# EasyEDA Pro project 25集创赛海云捷讯杯.epro, board PCB14_2
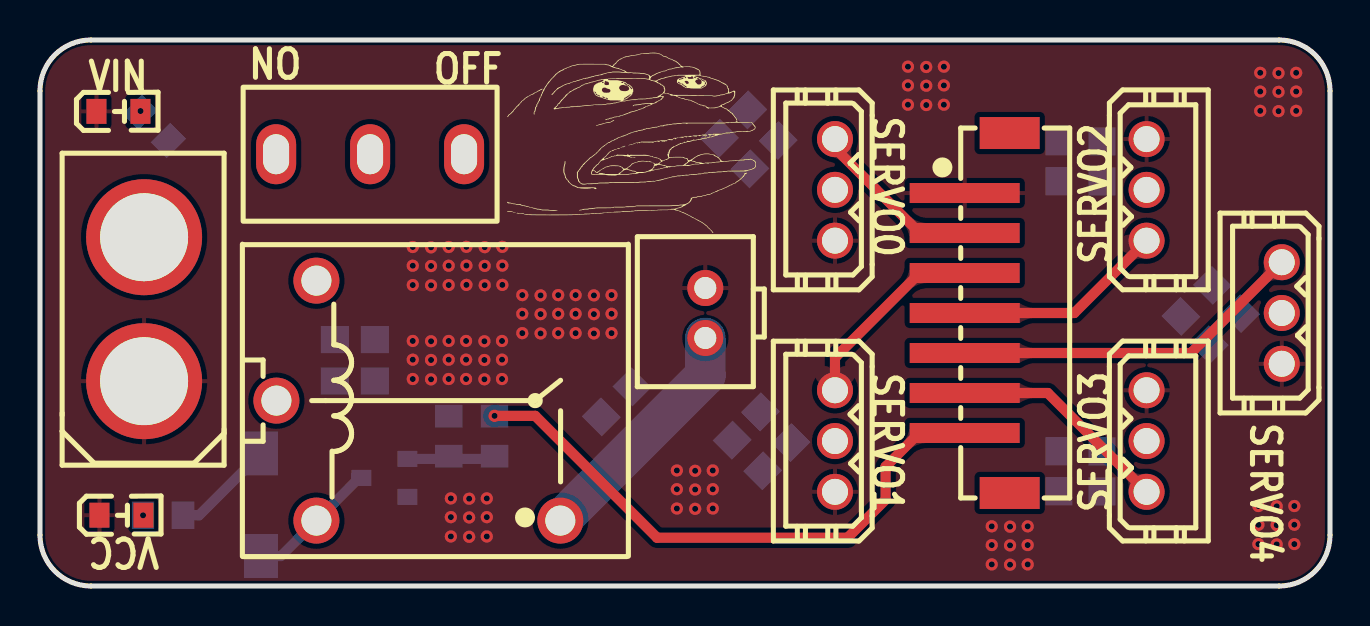
[diagram p12: board, top side]
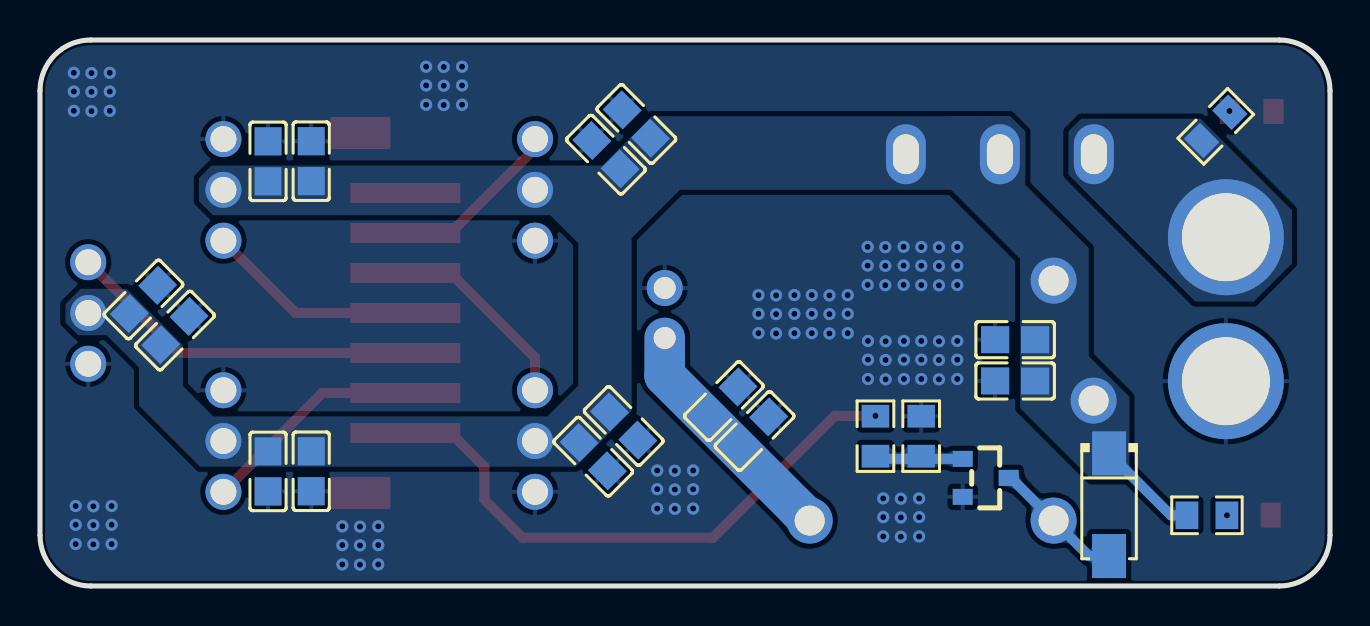
[diagram p13: board, bottom side, seen from below]

Outline 64.52 x 27.31 mm; copper layers: Top Layer, Bottom Layer. Coordinates in mm from the lower left corner of the outline.
Outline path: 0,24.77 0,2.54 arc(0.74,0.74) 2.54,0 61.98,0 arc(63.77,0.74) 64.52,2.54 64.52,24.77 arc(63.77,26.56) 61.98,27.31 2.54,27.31 arc(0.74,26.56) 0,24.77
Stack: Top Layer 0.035mm / Dielectric1 1.51mm FR4 er 4.5 / Bottom Layer 0.035mm

## Design rules (mm)
spacing copperThickness1oz (default): track to track 0.102, other pairs 0.152 to 0.3
spacing copperThickness2oz: track to track 0.203, other pairs 0.152 to 0.3
spacing Plane_innerPlane: track to track 0.102, other pairs 0.152 to 0.3
spacing Copper_copperRegion: track to track 0.102, other pairs 0.152 to 0.3
track width copperThickness1oz (default): min 0.127, default 0.254, max 2.54
track width copperThickness2oz: min 0.203, default 0.254, max 2.54
differential pair differentialPair (default): width min 0.127, default 0.254, max 2.54; gap min 0.152, default 0.152
pour e143 uses Copper_copperRegion
pour e212 uses Copper_copperRegion

## Placement (name value [footprint] x y rotation side)
C34  104  [C0805]  36.21 21.57 225 bottom
C35  106  [C0805]  34.69 23.1 225 bottom
C36  104  [C0805]  35.32 8 45 bottom
C37  106  [C0805]  36.85 6.47 45 bottom
C38  104  [C0805]  53.11 21.24 270 bottom
C39  106  [C0805]  50.95 21.24 270 bottom
C40  104  [C0805]  50.95 5.74 90 bottom
C41  106  [C0805]  53.11 5.73 90 bottom
C79  104  [C0805]  28.78 7.75 315 bottom
C80  106  [C0805]  30.31 9.25 315 bottom
C81  104  [C0805]  15.75 12.32 180 bottom
C82  106  [C0805]  15.75 10.25 180 bottom
C83  104  [C0805]  59.34 14.33 315 bottom
C84  106  [C0805]  57.77 12.77 315 bottom
CN2  5264-3A  [CONN-TH_5264-3A]  39.76 19.81 270 top
CN3  5264-3A  [CONN-TH_5264-3A]  39.76 7.25 270 top
CN4  5264-3A  [CONN-TH_5264-3A]  55.34 19.81 90 top
CN5  5264-3A  [CONN-TH_5264-3A]  55.34 7.25 90 top
CN15  5264-3A  [CONN-TH_5264-3A]  62.1 13.65 270 top
D1  SS14  [SMA_L4.2-W2.6-LS5.3-RD]  11.05 4.06 270 bottom
K1  SRD-5VDC-SL-A  [RELAY-TH_SRD-XXVDC-XX-A]  18.92 9.27 180 top
LED1  -  [LED_0805]  3.97 23.73 0 top
LED2  -  [LED_0805]  4.12 3.54 0 top
Q1  -  [S8050_SOT-23]  17.22 5.53 0 bottom
R7  10K  [R0805]  5.72 22.99 135 bottom
R8  10K  [R0805]  6.15 3.54 180 bottom
R17  10K  [R0805]  20.45 7.49 270 bottom
R18  1K  [R0805]  22.73 7.49 270 bottom
SW4  SS-12D10L5  [SW-TH_SS-12D10L5]  16.51 21.59 180 top
U3  BX-PH2.0-7PLT  [CONN-SMD_7P-P2.00_WAFER-200L-7P]  47.37 13.65 270 top
U17  HC-XHB-2A  [CONN-TH_2P-P2.50_HC-XHB-2AKK]  33.27 13.65 90 top
U18  XT60  [CONN-TH_XT60]  5.21 13.84 90 top

## Footprints (pads in the part's own frame, mm; a bottom-side part is the same pattern mirrored in y, then rotated)
C0805
  rect 1.41x1.35 smd: 1(-1,0) 2(1,0)
CONN-SMD_7P-P2.00_WAFER-200L-7P
  rect 1x5.5 smd: 1(-6,-1.125) 2(-4,-1.125) 3(-2,-1.125) 4(0,-1.125) 5(2,-1.125) 6(4,-1.125) 7(6,-1.125)
  rect 1.6x3 smd: 8(-9,1.125) 9(9,1.125)
CONN-TH_2P-P2.50_HC-XHB-2AKK
  round 1.8 hole 1.1: 1(-1.25,0) 2(1.25,0)
CONN-TH_5264-3A
  round 1.8 hole 1.3: 1(-2.54,0) 2(0,0) 3(2.54,0)
CONN-TH_XT60
  round 5.8 hole 4.4: 1(-3.6,0) 2(3.6,0)
LED_0805
  rect 1x1.25 smd: 1(-1.15,0.005) 2(1.05,0.005)
R0805
  rect 1.133x1.377 smd: 1(-1,0) 2(1,0)
RELAY-TH_SRD-XXVDC-XX-A
  round 2.3 hole 1.5: 1(-7.1,6) 2(5.099,-6) 3(7.1,0) 4(5.099,6)
S8050_SOT-23
  rect 1x0.8 smd: 1(1.15,-0.823) 2(1.15,1.077) 3(-1.15,0.127)
SMA_L4.2-W2.6-LS5.3-RD
  rect 2.2x1.7 smd: 1(-2.566,0) 2(2.566,0)
SW-TH_SS-12D10L5
  oval 2x3 hole 1.3x2: 1(-4.7,0) 2(0,0) 3(4.7,0)

## Nets
As in the schematic.

Pads without a net: U3 8 9

## Via types
v1: diameter 0.61, hole 0.305, Top Layer to Bottom Layer, 111 vias

## Routing (per net, layer and track width the routed paths; a pad name or vN(x,y) marks a point on that pad's centre or on a via; arc(x,y) is an arc through that point)
GND:
  vias: v1(18.64,16.95) v1(18.64,16.02) v1(18.64,15.05) v1(18.64,12.25) v1(18.64,11.32) v1(18.64,10.35) v1(19.56,16.94) v1(19.56,16) v1(19.56,15.04) v1(19.56,12.24) v1(19.56,11.3) v1(19.56,10.34) v1(20.44,16.95) v1(20.44,16.02) v1(20.44,15.05) v1(20.44,12.25) v1(20.44,11.32) v1(20.44,10.35) v1(20.55,4.38) v1(20.55,3.44) v1(20.55,2.48) v1(21.33,16.96) v1(21.33,16.02) v1(21.33,15.06) v1(21.31,12.25) v1(21.31,11.32) v1(21.31,10.35) v1(21.46,4.37) v1(21.46,3.43) v1(21.46,2.46) v1(22.24,16.95) v1(22.24,16.01) v1(22.24,15.04) v1(22.22,12.24) v1(22.22,11.3) v1(22.22,10.34) v1(22.34,4.38) v1(22.34,3.44) v1(22.34,2.48) v1(23.12,16.96) v1(23.12,16.02) v1(23.12,15.06) v1(23.11,12.25) v1(23.11,11.32) v1(23.11,10.35) v1(24.12,14.55) v1(24.12,13.61) v1(24.12,12.65) v1(25.04,14.53) v1(25.04,13.6) v1(25.04,12.63) v1(25.92,14.55) v1(25.92,13.61) v1(25.92,12.65) v1(26.79,14.55) v1(26.79,13.61) v1(26.79,12.65) v1(27.7,14.53) v1(27.7,13.6) v1(27.7,12.63) v1(28.58,14.55) v1(28.58,13.61) v1(28.58,12.65) v1(31.85,5.78) v1(31.85,4.84) v1(31.85,3.87) v1(32.77,5.76) v1(32.77,4.83) v1(32.77,3.86) v1(33.65,5.78) v1(33.65,4.84) v1(33.65,3.87) v1(43.41,25.97) v1(43.41,25.03) v1(43.41,24.07) v1(44.32,25.96) v1(44.32,25.02) v1(44.32,24.05) v1(45.21,25.97) v1(45.21,25.03) v1(45.21,24.07) v1(47.6,2.98) v1(47.6,2.05) v1(47.6,1.08) v1(48.51,2.97) v1(48.51,2.03) v1(48.51,1.07) v1(49.4,2.98) v1(49.4,2.05) v1(49.4,1.08) v1(60.93,4) v1(60.93,3.06) v1(60.93,2.1) v1(61.03,25.66) v1(61.03,24.73) v1(61.03,23.76) v1(61.85,3.98) v1(61.85,3.05) v1(61.85,2.08) v1(61.94,25.65) v1(61.94,24.71) v1(61.94,23.75) v1(62.73,4) v1(62.73,3.06) v1(62.73,2.1) v1(62.82,25.66) v1(62.82,24.73) v1(62.82,23.76)
VCC: length 5.2
  Bottom Layer w0.508: R8.1 7.96,3.54 D1.1
VIN: length 0.5
  Bottom Layer w0.508: 7.03,17.69 7.37,18.03
AIR_PUMP: length 29.2
  Top Layer w0.508: v1(22.73,8.51) 24.76,8.51 30.86,2.41 40.39,2.41 42.29,4.32 42.29,5.97 43.97,7.65 U3.7
PUMP_IN: length 12.1
  Bottom Layer w2.032: K1.1 33.27,10.52 U17.1
SERVO0: length 8.7
  Top Layer w0.508: U3.2 44,17.65 39.76,21.89 CN2.1
SERVO1: length 9.9
  Top Layer w0.508: U3.3 44,15.65 39.76,11.42 CN3.1
SERVO2: length 10.6
  Top Layer w0.508: U3.4 51.73,13.65 CN4.1
SERVO3: length 11.1
  Top Layer w0.508: U3.6 50.4,9.65 CN5.1
SERVO4: length 17.7
  Top Layer w0.508: U3.5 57.56,11.65 CN15.1
$1N331:
  vias: v1(5.03,23.75)
$1N333:
  vias: v1(5.15,3.54)
$1N2486: length 4.3
  Bottom Layer w0.508: 20.78,6.36 23.03,6.36 ; Q1.1 20.4,6.36
$1N2490: length 6.6
  Bottom Layer w0.508: D1.2 12.05,1.5 K1.4 15.82,5.27 15.82,5.53

## Copper pours and planes (outline as drawn; the poured copper is in the pictures)
GND on Top Layer: -18.54,29.72 76.71,29.72 76.71,-2.41 -18.54,-2.41
GND on Bottom Layer: -4.7,33.27 72.9,33.27 72.9,-5.71 -4.7,-5.71
VCC on Bottom Layer: 10.03,18.67 15.49,18.67 15.49,5.33 10.03,5.33
VCC on Bottom Layer: 15.24,23.5 56.57,23.5 56.57,5.97 15.24,5.97
VCC on Bottom Layer: 12.06,23.5 18.95,23.5 18.95,15.88 12.06,15.88
VCC on Bottom Layer: 55.82,14.86 63.25,14.86 63.25,5.97 55.82,5.97
VIN on Bottom Layer: 1.91,23.37 13.08,23.37 13.08,14.22 1.91,14.22

Small or netless copper shapes (teardrops, artwork), in the pictures only: 12 on Top Layer, 11 on Bottom Layer

## Text on the board
Top Silkscreen Layer: VIN | OFF | SERVO2 | SERVO3 | VCC | ON | SERVO0 | SERVO1 | SERVO4
